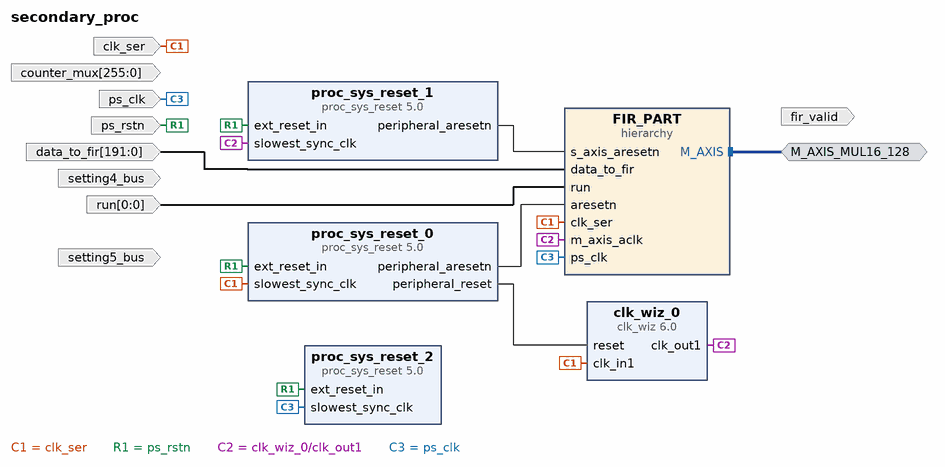
[diagram p0: block diagram of the top level]
# Vivado block design secondary_proc, xck26-sfvc784-2LV-c, Vivado 2020.2.2
create_bd_design secondary_proc

create_bd_intf_port -mode Master -vlnv xilinx.com:interface:axis_rtl:1.0 M_AXIS_MUL16_128
set_property -dict {CONFIG.FREQ_HZ 247500000} [get_bd_intf_ports M_AXIS_MUL16_128]
create_bd_port -dir I -type clk clk_ser
set_property -dict {CONFIG.FREQ_HZ 80000000} [get_bd_ports clk_ser]
create_bd_port -dir I -type rst ps_rstn
create_bd_port -dir I -from 191 -to 0 data_to_fir
create_bd_port -dir I -from 0 -to 0 run
create_bd_port -dir I setting4_bus
create_bd_port -dir I setting5_bus
create_bd_port -dir O fir_valid
create_bd_port -dir I -type clk ps_clk
set_property -dict {CONFIG.ASSOCIATED_BUSIF M_AXIS_MUL16_128 CONFIG.FREQ_HZ 247500000} [get_bd_ports ps_clk]
create_bd_port -dir I -from 255 -to 0 counter_mux

create_bd_cell -type ip -vlnv xilinx.com:ip:clk_wiz:6.0 clk_wiz_0
set_property -dict [list \
  CONFIG.CLKIN1_JITTER_PS 125.0 \
  CONFIG.CLKOUT1_DRIVES Buffer \
  CONFIG.CLKOUT1_JITTER 105.878 \
  CONFIG.CLKOUT1_PHASE_ERROR 92.039 \
  CONFIG.CLKOUT1_REQUESTED_OUT_FREQ 200.000 \
  CONFIG.CLKOUT2_DRIVES Buffer \
  CONFIG.CLKOUT3_DRIVES Buffer \
  CONFIG.CLKOUT4_DRIVES Buffer \
  CONFIG.CLKOUT5_DRIVES Buffer \
  CONFIG.CLKOUT6_DRIVES Buffer \
  CONFIG.CLKOUT7_DRIVES Buffer \
  CONFIG.MMCM_CLKFBOUT_MULT_F 15.000 \
  CONFIG.MMCM_CLKIN1_PERIOD 12.500 \
  CONFIG.MMCM_CLKOUT0_DIVIDE_F 6.000 \
  CONFIG.PRIM_IN_FREQ 80.000 \
  CONFIG.SECONDARY_SOURCE Single_ended_clock_capable_pin \
  CONFIG.USE_PHASE_ALIGNMENT true \
] [get_bd_cells clk_wiz_0]
create_bd_cell -type ip -vlnv xilinx.com:ip:proc_sys_reset:5.0 proc_sys_reset_0
create_bd_cell -type ip -vlnv xilinx.com:ip:proc_sys_reset:5.0 proc_sys_reset_1
create_bd_cell -type ip -vlnv xilinx.com:ip:proc_sys_reset:5.0 proc_sys_reset_2
create_bd_cell -type hier FIR_PART

# ---- hierarchy /FIR_PART ----
current_bd_instance /FIR_PART
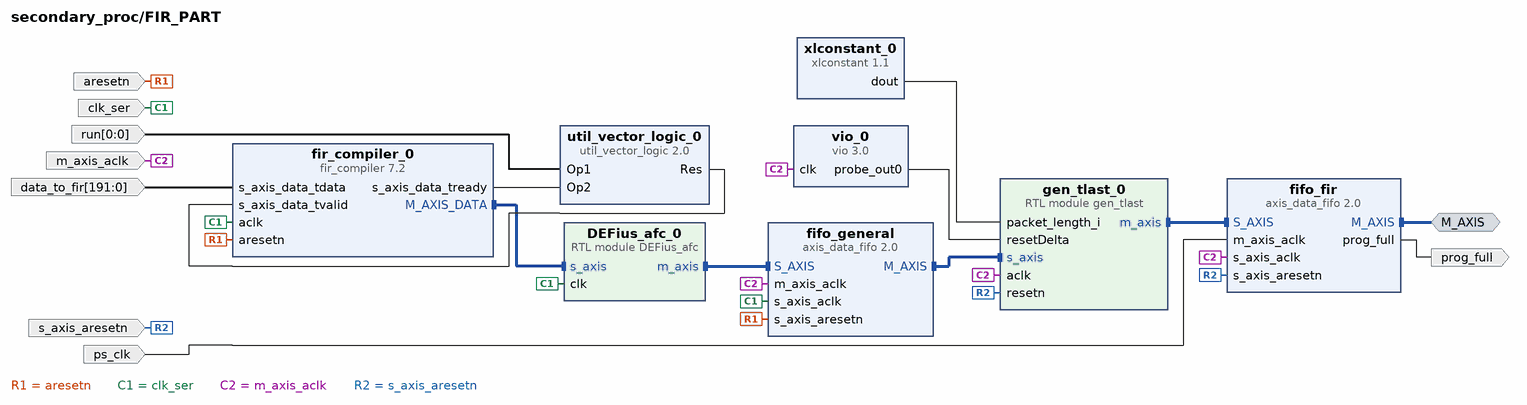
[diagram p1: block diagram inside /FIR_PART]
create_bd_intf_pin -mode Master -vlnv xilinx.com:interface:axis_rtl:1.0 M_AXIS
create_bd_pin -dir I -type rst aresetn
create_bd_pin -dir I -type clk clk_ser
create_bd_pin -dir I -from 191 -to 0 data_to_fir
create_bd_pin -dir I -type clk m_axis_aclk
create_bd_pin -dir I -type rst s_axis_aresetn
create_bd_pin -dir I -type clk ps_clk
create_bd_pin -dir O prog_full
create_bd_pin -dir I -from 0 -to 0 run

create_bd_cell -type ip -vlnv xilinx.com:ip:fir_compiler:7.2 fir_compiler_0
set_property -dict [list \
  CONFIG.Clock_Frequency 80 \
  CONFIG.CoefficientSource COE_File \
  CONFIG.Coefficient_Fanout true \
  CONFIG.Coefficient_File ../../../../../../80to5.coe \
  CONFIG.Coefficient_Fractional_Bits 0 \
  CONFIG.Coefficient_Sets 1 \
  CONFIG.Coefficient_Sign Signed \
  CONFIG.Coefficient_Structure Inferred \
  CONFIG.Coefficient_Width 25 \
  CONFIG.ColumnConfig 3 \
  CONFIG.Control_Broadcast_Fanout true \
  CONFIG.Control_Column_Fanout true \
  CONFIG.Control_LUT_Pipeline true \
  CONFIG.Control_Path_Fanout true \
  CONFIG.Data_Path_Broadcast false \
  CONFIG.Data_Path_Fanout true \
  CONFIG.Data_Width 24 \
  CONFIG.Decimation_Rate 16 \
  CONFIG.Disable_Half_Band_Centre_Tap false \
  CONFIG.Filter_Architecture Systolic_Multiply_Accumulate \
  CONFIG.Filter_Type Decimation \
  CONFIG.Has_ARESETn true \
  CONFIG.Interpolation_Rate 1 \
  CONFIG.M_DATA_Has_TREADY true \
  CONFIG.No_BRAM_Read_First_Mode true \
  CONFIG.No_SRL_Attributes false \
  CONFIG.Number_Channels 1 \
  CONFIG.Number_Paths 8 \
  CONFIG.Optimal_Column_Lengths true \
  CONFIG.Optimization_Goal Speed \
  CONFIG.Optimization_List Data_Path_Fanout,Pre-Adder_Pipeline,Coefficient_Fanout,Control_Path_Fanout,Control_Column_Fanout,Control_Broadcast_Fanout,Control_LUT_Pipeline,No_BRAM_Read_First_Mode,Optimal_Column_Lengths,Other \
  CONFIG.Optimization_Selection All \
  CONFIG.Other true \
  CONFIG.Output_Rounding_Mode Convergent_Rounding_to_Even \
  CONFIG.Output_Width 24 \
  CONFIG.Pre_Adder_Pipeline true \
  CONFIG.Quantization Integer_Coefficients \
  CONFIG.RateSpecification Frequency_Specification \
  CONFIG.Sample_Frequency 80 \
  CONFIG.Zero_Pack_Factor 1 \
] [get_bd_cells fir_compiler_0]
create_bd_cell -type ip -vlnv xilinx.com:ip:xlconstant:1.1 xlconstant_0
set_property -dict {CONFIG.CONST_VAL 5000 CONFIG.CONST_WIDTH 13} [get_bd_cells xlconstant_0]
create_bd_cell -type module -reference DEFius_afc DEFius_afc_0
create_bd_cell -type ip -vlnv xilinx.com:ip:axis_data_fifo:2.0 fifo_fir
set_property -dict [list \
  CONFIG.FIFO_DEPTH 8192 \
  CONFIG.FIFO_MODE 2 \
  CONFIG.HAS_PROG_FULL 1 \
  CONFIG.IS_ACLK_ASYNC 1 \
  CONFIG.PROG_FULL_THRESH 8187 \
  CONFIG.TDATA_NUM_BYTES 16 \
] [get_bd_cells fifo_fir]
create_bd_cell -type ip -vlnv xilinx.com:ip:util_vector_logic:2.0 util_vector_logic_0
set_property -dict {CONFIG.C_SIZE 1} [get_bd_cells util_vector_logic_0]
create_bd_cell -type ip -vlnv xilinx.com:ip:axis_data_fifo:2.0 fifo_general
set_property -dict [list \
  CONFIG.FIFO_DEPTH 8192 \
  CONFIG.FIFO_MODE 1 \
  CONFIG.HAS_PROG_FULL 1 \
  CONFIG.HAS_TLAST 1 \
  CONFIG.IS_ACLK_ASYNC 1 \
  CONFIG.PROG_FULL_THRESH 8180 \
  CONFIG.TDATA_NUM_BYTES 16 \
] [get_bd_cells fifo_general]
create_bd_cell -type ip -vlnv xilinx.com:ip:vio:3.0 vio_0
set_property -dict {CONFIG.C_NUM_PROBE_IN 0 CONFIG.C_PROBE_OUT0_WIDTH 14} [get_bd_cells vio_0]
create_bd_cell -type module -reference gen_tlast gen_tlast_0
set_property -dict {CONFIG.MAX_PKT_LENGTH 5000} [get_bd_cells gen_tlast_0]

# ---- connections ----

current_bd_instance /FIR_PART
connect_bd_intf_net [get_bd_intf_pins DEFius_afc_0/m_axis] [get_bd_intf_pins fifo_general/S_AXIS]
connect_bd_intf_net [get_bd_intf_pins fifo_general/M_AXIS] [get_bd_intf_pins gen_tlast_0/s_axis]
connect_bd_intf_net [get_bd_intf_pins M_AXIS] [get_bd_intf_pins fifo_fir/M_AXIS]
connect_bd_intf_net [get_bd_intf_pins fir_compiler_0/M_AXIS_DATA] [get_bd_intf_pins DEFius_afc_0/s_axis]
connect_bd_intf_net [get_bd_intf_pins gen_tlast_0/m_axis] [get_bd_intf_pins fifo_fir/S_AXIS]
connect_bd_net [get_bd_pins xlconstant_0/dout] [get_bd_pins gen_tlast_0/packet_length_i]
connect_bd_net -net proc_sys_reset_0_peripheral_aresetn [get_bd_pins aresetn] \
  [get_bd_pins fir_compiler_0/aresetn] [get_bd_pins fifo_general/s_axis_aresetn]
connect_bd_net [get_bd_pins clk_ser] [get_bd_pins DEFius_afc_0/clk] [get_bd_pins fir_compiler_0/aclk] [get_bd_pins fifo_general/s_axis_aclk]
connect_bd_net [get_bd_pins data_to_fir] [get_bd_pins fir_compiler_0/s_axis_data_tdata]
connect_bd_net -net clk_wiz_0_clk_out1 [get_bd_pins m_axis_aclk] \
  [get_bd_pins fifo_fir/s_axis_aclk] [get_bd_pins fifo_general/m_axis_aclk] [get_bd_pins gen_tlast_0/aclk] \
  [get_bd_pins vio_0/clk]
connect_bd_net -net proc_sys_reset_1_peripheral_aresetn [get_bd_pins s_axis_aresetn] \
  [get_bd_pins fifo_fir/s_axis_aresetn] [get_bd_pins gen_tlast_0/resetn]
connect_bd_net [get_bd_pins ps_clk] [get_bd_pins fifo_fir/m_axis_aclk]
connect_bd_net [get_bd_pins fifo_fir/prog_full] [get_bd_pins prog_full]
connect_bd_net [get_bd_pins util_vector_logic_0/Res] [get_bd_pins fir_compiler_0/s_axis_data_tvalid]
connect_bd_net [get_bd_pins fir_compiler_0/s_axis_data_tready] [get_bd_pins util_vector_logic_0/Op2]
connect_bd_net [get_bd_pins run] [get_bd_pins util_vector_logic_0/Op1]
connect_bd_net [get_bd_pins vio_0/probe_out0] [get_bd_pins gen_tlast_0/resetDelta]

current_bd_instance /
connect_bd_intf_net [get_bd_intf_ports M_AXIS_MUL16_128] [get_bd_intf_pins FIR_PART/M_AXIS]
connect_bd_net [get_bd_ports clk_ser] [get_bd_pins proc_sys_reset_0/slowest_sync_clk] [get_bd_pins clk_wiz_0/clk_in1] [get_bd_pins FIR_PART/clk_ser]
connect_bd_net [get_bd_ports ps_rstn] \
  [get_bd_pins proc_sys_reset_1/ext_reset_in] [get_bd_pins proc_sys_reset_0/ext_reset_in] \
  [get_bd_pins proc_sys_reset_2/ext_reset_in]
connect_bd_net [get_bd_pins proc_sys_reset_1/peripheral_aresetn] [get_bd_pins FIR_PART/s_axis_aresetn]
connect_bd_net [get_bd_pins clk_wiz_0/clk_out1] [get_bd_pins proc_sys_reset_1/slowest_sync_clk] [get_bd_pins FIR_PART/m_axis_aclk]
connect_bd_net [get_bd_pins proc_sys_reset_0/peripheral_reset] [get_bd_pins clk_wiz_0/reset]
connect_bd_net [get_bd_ports data_to_fir] [get_bd_pins FIR_PART/data_to_fir]
connect_bd_net [get_bd_pins proc_sys_reset_0/peripheral_aresetn] [get_bd_pins FIR_PART/aresetn]
connect_bd_net -net m_axis_aclk_0_1 [get_bd_ports ps_clk] [get_bd_pins proc_sys_reset_2/slowest_sync_clk] [get_bd_pins FIR_PART/ps_clk]
connect_bd_net [get_bd_ports run] [get_bd_pins FIR_PART/run]

validate_bd_design
save_bd_design
